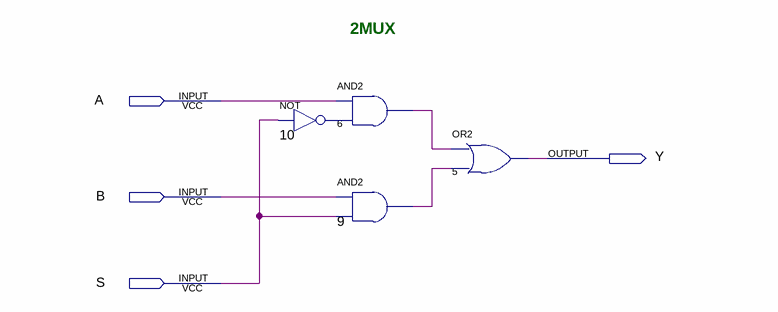
[diagram p0: schematic sheet]
// Quartus schematic 2MUX.bdf as structural Verilog: 4 symbols, 4 pins
module \2MUX  (
  input  A,
  input  B,
  input  S,
  output Y
);

  wire n6_out, n9_out, n10_out;

  not u_10 (n10_out, S);
  and u_6 (n6_out, A, n10_out);
  and u_9 (n9_out, B, S);
  or u_5 (Y, n6_out, n9_out);

  // Notes on the sheet:
  //   2MUX
endmodule
